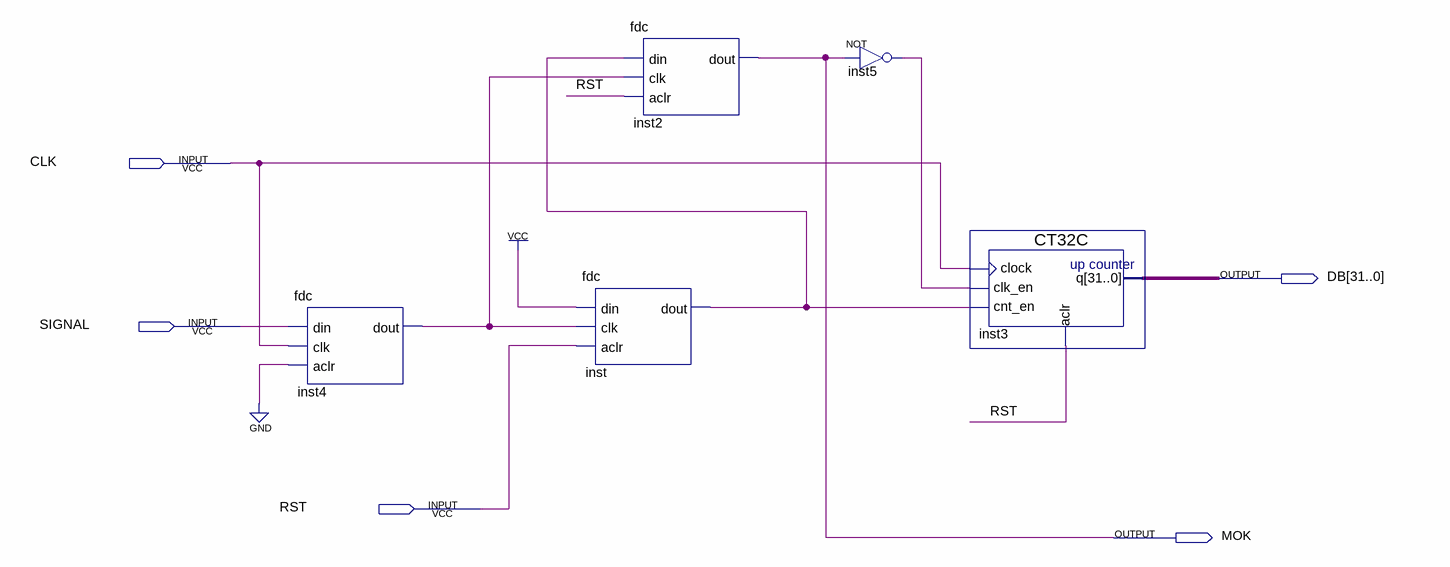
[diagram p0: schematic sheet]
// Quartus schematic MFREQ.bdf as structural Verilog: 5 symbols, 5 pins
module MFREQ (
  input  CLK,
  input  SIGNAL,
  input  RST,
  output [31:0] DB,
  output MOK
);

  wire inst4_dout, inst5_out, inst_dout;

  fdc inst4 (.din(SIGNAL), .clk(CLK), .aclr(1'b0), .dout(inst4_dout));
  fdc inst (.din(1'b1), .clk(inst4_dout), .aclr(RST), .dout(inst_dout));
  fdc inst2 (.din(inst_dout), .clk(inst4_dout), .aclr(RST), .dout(MOK));
  not inst5 (inst5_out, MOK);
  CT32C inst3 (.clock(CLK), .clk_en(inst5_out), .cnt_en(inst_dout), .aclr(RST), .q(DB));
endmodule
